# Altium schematic sheet Sheet_2_2021-06-07.schdoc
size 312 x 219 mm
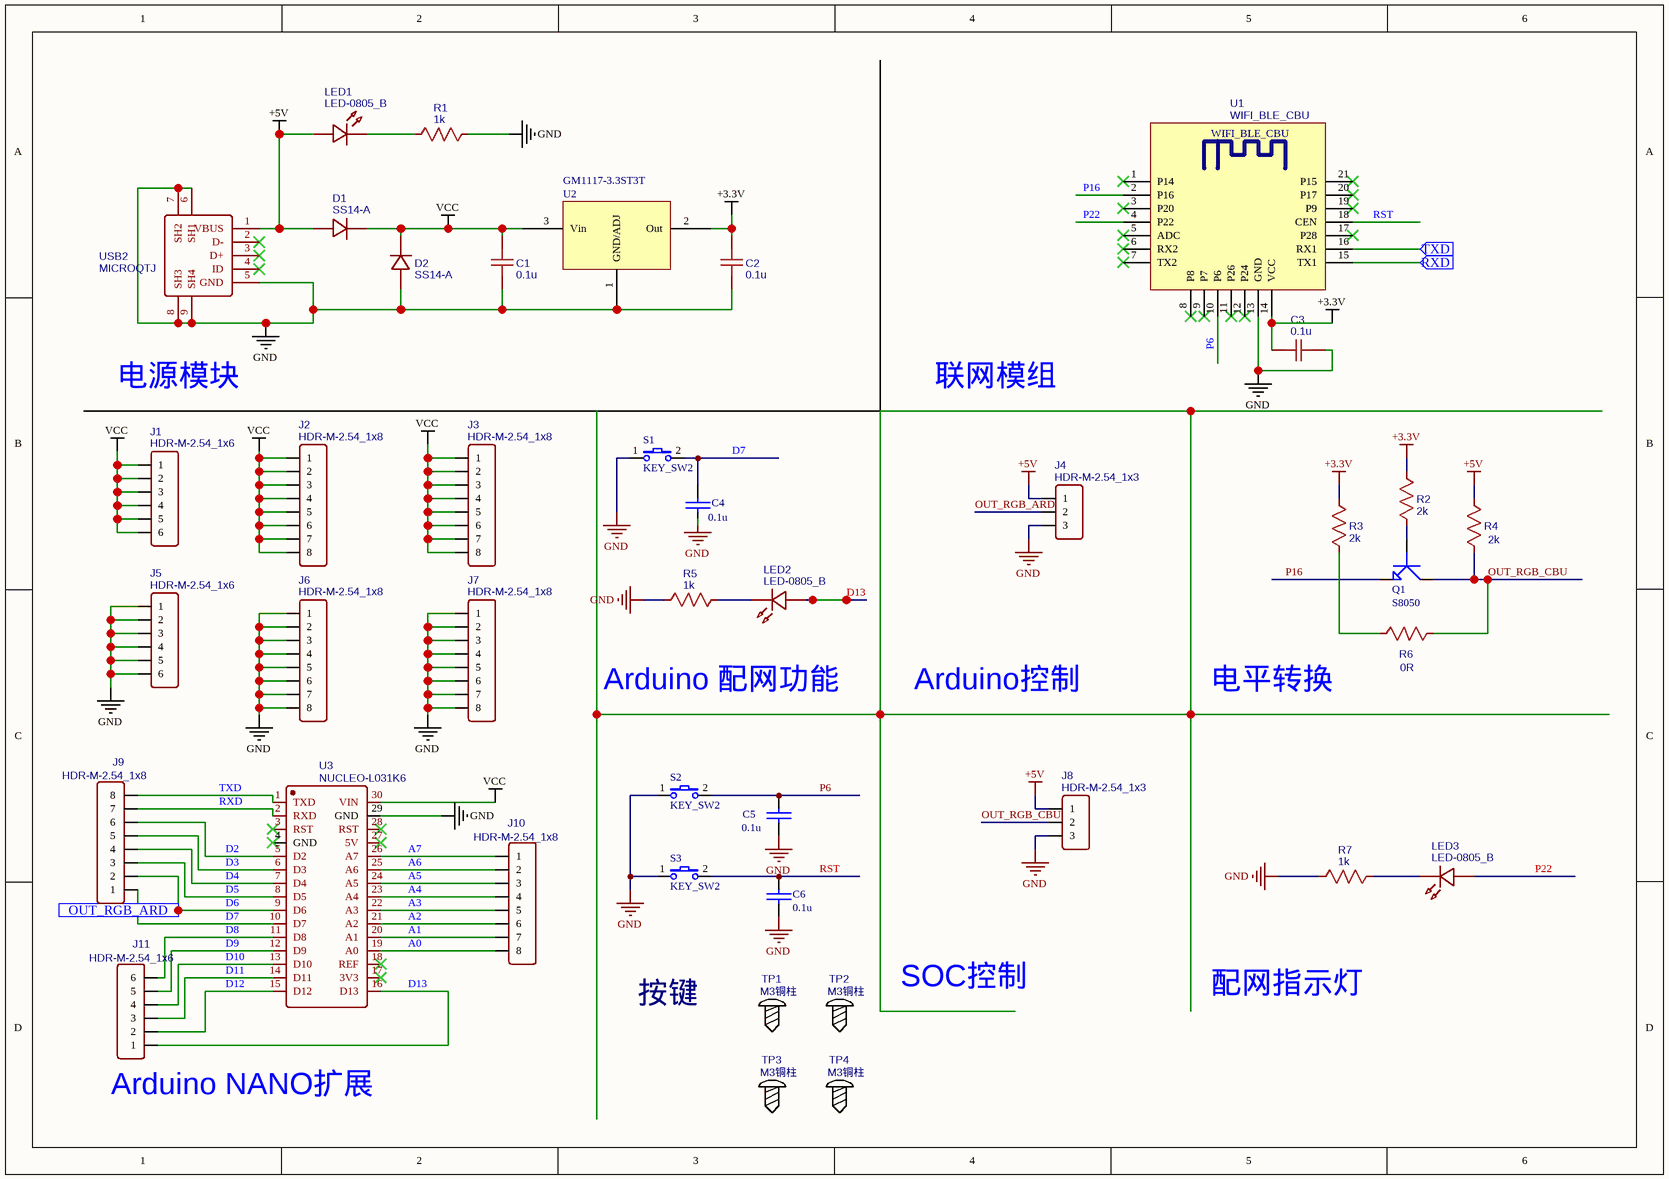
[diagram p0: Sheet_2_2021-06-07.schdoc]

## Parts
C1  0.1u  [C0603]
C2  0.1u  [C0603]
C3  0.1u  [C0603]
C4  0.1u  [C0603]
C5  0.1u  [C0603]
C6  0.1u  [C0603]
D1  SS14-A  [SMA_L4.3-W2.6-LS5.2-RD]
D2  SS14-A  [SMA_L4.3-W2.6-LS5.2-RD]
J1  HDR-M-2.54_1x6  [HDR-M-2.54_1X6]
J2  HDR-M-2.54_1x8  [HDR-M-2.54_1X8]
J3  HDR-M-2.54_1x8  [HDR-M-2.54_1X8]
J4  HDR-M-2.54_1x3  [HDR-M-2.54_1X3]
J5  HDR-M-2.54_1x6  [HDR-M-2.54_1X6]
J6  HDR-M-2.54_1x8  [HDR-M-2.54_1X8]
J7  HDR-M-2.54_1x8  [HDR-M-2.54_1X8]
J8  HDR-M-2.54_1x3  [HDR-M-2.54_1X3]
J9  HDR-M-2.54_1x8  [HDR-M-2.54_1X8]
J10  HDR-M-2.54_1x8  [HDR-M-2.54_1X8]
J11  HDR-M-2.54_1x6  [HDR-M-2.54_1X6]
LED1  LED-0805_B  [LED0805_BLUE]
LED2  LED-0805_B  [LED0805_BLUE]
LED3  LED-0805_B  [LED0805_BLUE]
Q1  S8050  [SOT-23-NPN]
R1  1k  [R0603]
R2  2k  [R0603]
R3  2k  [R0603]
R4  2k  [R0603]
R5  1k  [R0603]
R6  0R  [R0603]
R7  1k  [R0603]
S1  KEY_SW2  [KEY4-SMD]
S2  KEY_SW2  [KEY4-SMD]
S3  KEY_SW2  [KEY4-SMD]
TP1  M3铜柱  [M3铜柱]
TP2  M3铜柱  [M3铜柱]
TP3  M3铜柱  [M3铜柱]
TP4  M3铜柱  [M3铜柱]
U1  WIFI_BLE_CBU  [WIFI_BLE_CBU]
U2  GM1117-3.3ST3T  [SOT-223]
U3  NUCLEO-L031K6  [ARDUINO_NANO]
USB2  MICROQTJ  [MICRO-USB-SMD_MICROQTJ]

## Ports
OUT_RGB_ARD (in), RXD (in), TXD (in)

## Nets
+3.3V: C2.2 C3.1 R2.2 R3.2 U1.14(VCC) U2.2(Out)
+5V: D1.2(A) J4.1 J8.1 LED1.1 R4.2 USB2.1(VBUS)
GND: C1.1 C2.1 C3.2 C4.1 C5.1 C6.2 D2.2(A) J4.3 J5.1 J5.2 J5.3 J5.4 J5.5 J5.6 J6.1 J6.2 J6.3 J6.4 J6.5 J6.6 J6.7 J6.8 J7.1 J7.2 J7.3 J7.4 J7.5 J7.6 J7.7 J7.8 J8.3 R1.2 R5.1 R7.1 S1.1 S2.1 S3.1 U1.13(GND) U2.1(GND/ADJ) U3.29(GND) USB2.5(GND) USB2.6(SH1) USB2.7(SH2) USB2.8(SH3) USB2.9(SH4)
VCC: C1.2 D1.1(C) D2.1(C) J1.1 J1.2 J1.3 J1.4 J1.5 J1.6 J2.1 J2.2 J2.3 J2.4 J2.5 J2.6 J2.7 J2.8 J3.1 J3.2 J3.3 J3.4 J3.5 J3.6 J3.7 J3.8 U2.3(Vin) U3.30(VIN)
A0: J10.8 U3.19(A0)
A1: J10.7 U3.20(A1)
A2: J10.6 U3.21(A2)
A3: J10.5 U3.22(A3)
A4: J10.4 U3.23(A4)
A5: J10.3 U3.24(A5)
A6: J10.2 U3.25(A6)
A7: J10.1 U3.26(A7)
D2: J9.6 U3.5(D2)
D3: J9.5 U3.6(D3)
D4: J9.4 U3.7(D4)
D5: J9.3 U3.8(D5)
D6: J9.2 U3.9(D6) ; port OUT_RGB_ARD
D7: C4.2 J9.1 S1.2 U3.10(D7)
D8: J11.6 U3.11(D8)
D9: J11.5 U3.12(D9)
D10: J11.4 U3.13(D10)
D11: J11.3 U3.14(D11)
D12: J11.2 U3.15(D12)
D13: J11.1 LED2.1 U3.16(D13)
OUT_RGB_ARD: J4.2
OUT_RGB_CBU: J8.2 Q1.3(C) R4.1 R6.1
P6: C5.2 S2.2 U1.10(P6)
P16: Q1.1(E) U1.2(P16)
P22: LED3.1 U1.4(P22)
RST: C6.1 S3.2 U1.18(CEN)
RXD: J9.7 U3.2(RXD)
RXD: U1.15(TX1) ; port RXD  [a separate net that carries the same name]
TXD: J9.8 U3.1(TXD)
TXD: U1.16(RX1) ; port TXD  [a separate net that carries the same name]
NetLED1_2: LED1.2 R1.1
NetLED2_2: LED2.2 R5.2
NetLED3_2: LED3.2 R7.2
NetQ1_2: Q1.2(B) R2.1
NetR3_1: R3.1 R6.2

Not connected (* = marked no-connect by the designer): U1 1(P14)* 3(P20)* 5(ADC)* 6(RX2)* 7(TX2)* 8(P8)* 9(P7)* 11(P26)* 12(P24)* 17(P28)* 19(P9)* 20(P17)* 21(P15)*; U3 3(RST)* 4(GND)* 17(3V3)* 18(REF)* 27(5V)* 28(RST)*; USB2 2(D-)* 3(D+)* 4(ID)*

## Notes on the sheet
- 电源模块
- 联网模组
- Arduino 配网功能
- Arduino控制
- 电平转换
- SOC控制
- 配网指示灯
- 按键
- (near J11) Arduino NANO扩展

## Library data of the parts
C1-C3 = 0.1u: nameAlias: Value(F); Contributor: LCEDA_Lib; spicePre: C; spiceSymbolName: C_0603_US
D1 D2 = SS14-A: BOM_Manufacturer: Formosa Microsemi; Contributor: LCSC; BOM_Supplier: LCSC; BOM_Supplier Part: C143193; BOM_Manufacturer Part: SS14-A; BOM_JLCPCB Part Class: Extended Part; spicePre: D; spiceSymbolName: SS14-A
J1 J5 J11 = HDR-M-2.54_1x6: Contributor: LCEDA_Lib; BOM_Supplier Part: C190819; BOM_Supplier: LCSC; spicePre: J; spiceSymbolName: HDR-M-2.54_1x6
J2 J3 J6 J7 J9 J10 = HDR-M-2.54_1x8: Contributor: LCEDA_Lib; BOM_Supplier Part: C190820; BOM_Supplier: LCSC; spicePre: J; spiceSymbolName: HDR-M-2.54_1x8
J4 J8 = HDR-M-2.54_1x3: Contributor: LCEDA_Lib; BOM_Supplier Part: C180248; BOM_Supplier: LCSC; spicePre: J; spiceSymbolName: HDR-M-2.54_1x3
LED1-LED3 = LED-0805_B: BOM_Manufacturer: 方舟 ARKLED; BOM_Manufacturer Part: D-B080508B1-KS2; Contributor: LCEDA_Lib; BOM_Supplier Part: C108412; spicePre: L; spiceSymbolName: LED-0805_B
R1 R5 R7 = 1k: nameAlias: Value(Ω); Contributor: LCEDA_Lib; spicePre: R; spiceSymbolName: R_0603_US
R2-R4 = 2k: nameAlias: Value(Ω); Contributor: LCEDA_Lib; spicePre: R; spiceSymbolName: R_0603_US
R6 = 0R: nameAlias: Value(Ω); Contributor: LCEDA_Lib; spicePre: R; spiceSymbolName: R_0603_US
TP1-TP4 = M3铜柱: Contributor: qq77; spicePre: T; spiceSymbolName: M3铜柱
U1 = WIFI_BLE_CBU: Contributor: azcw; spicePre: U; spiceSymbolName: WIFI_BLE_CBU
U3 = NUCLEO-L031K6: BOM_Manufacturer: STMicroelectronics; BOM_Supplier: LCSC; BOM_Manufacturer Part: NUCLEO-L031K6; BOM_Supplier Part: C94083; spicePre: U; spiceSymbolName: NUCLEO-L031K6
USB2 = MICROQTJ: BOM_Manufacturer: SHOU HAN; Contributor: LCSC; BOM_Supplier: LCSC; BOM_Supplier Part: C404968; BOM_Manufacturer Part: MicroQTJ; BOM_JLCPCB Part Class: Extended Part; spicePre: U; spiceSymbolName: MICROQTJ